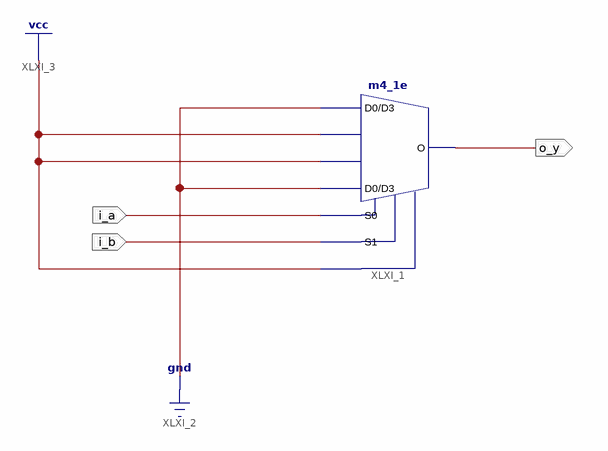
[diagram p0: schematic sheet 1]
// Xilinx ISE schematic Laby6.sch (spartan3e) as structural Verilog: 1 symbols, 3 ports
module Laby6 (
  input  i_b,
  input  i_a,
  output o_y
);

  m4_1e XLXI_1 (.D0(1'b0), .D1(1'b1), .D2(1'b1), .D3(1'b0), .E(1'b1), .S0(i_a), .S1(i_b), .O(o_y));
endmodule
